# EasyEDA schematic SCH_BQ2954 PMIC_v1_2023-05-05.json
TITLE: BQ2954; REV: 1.0; Date: 2022-12-19; Sheet: 1/1; Drawn By: richwasnothere; Company: Your Company
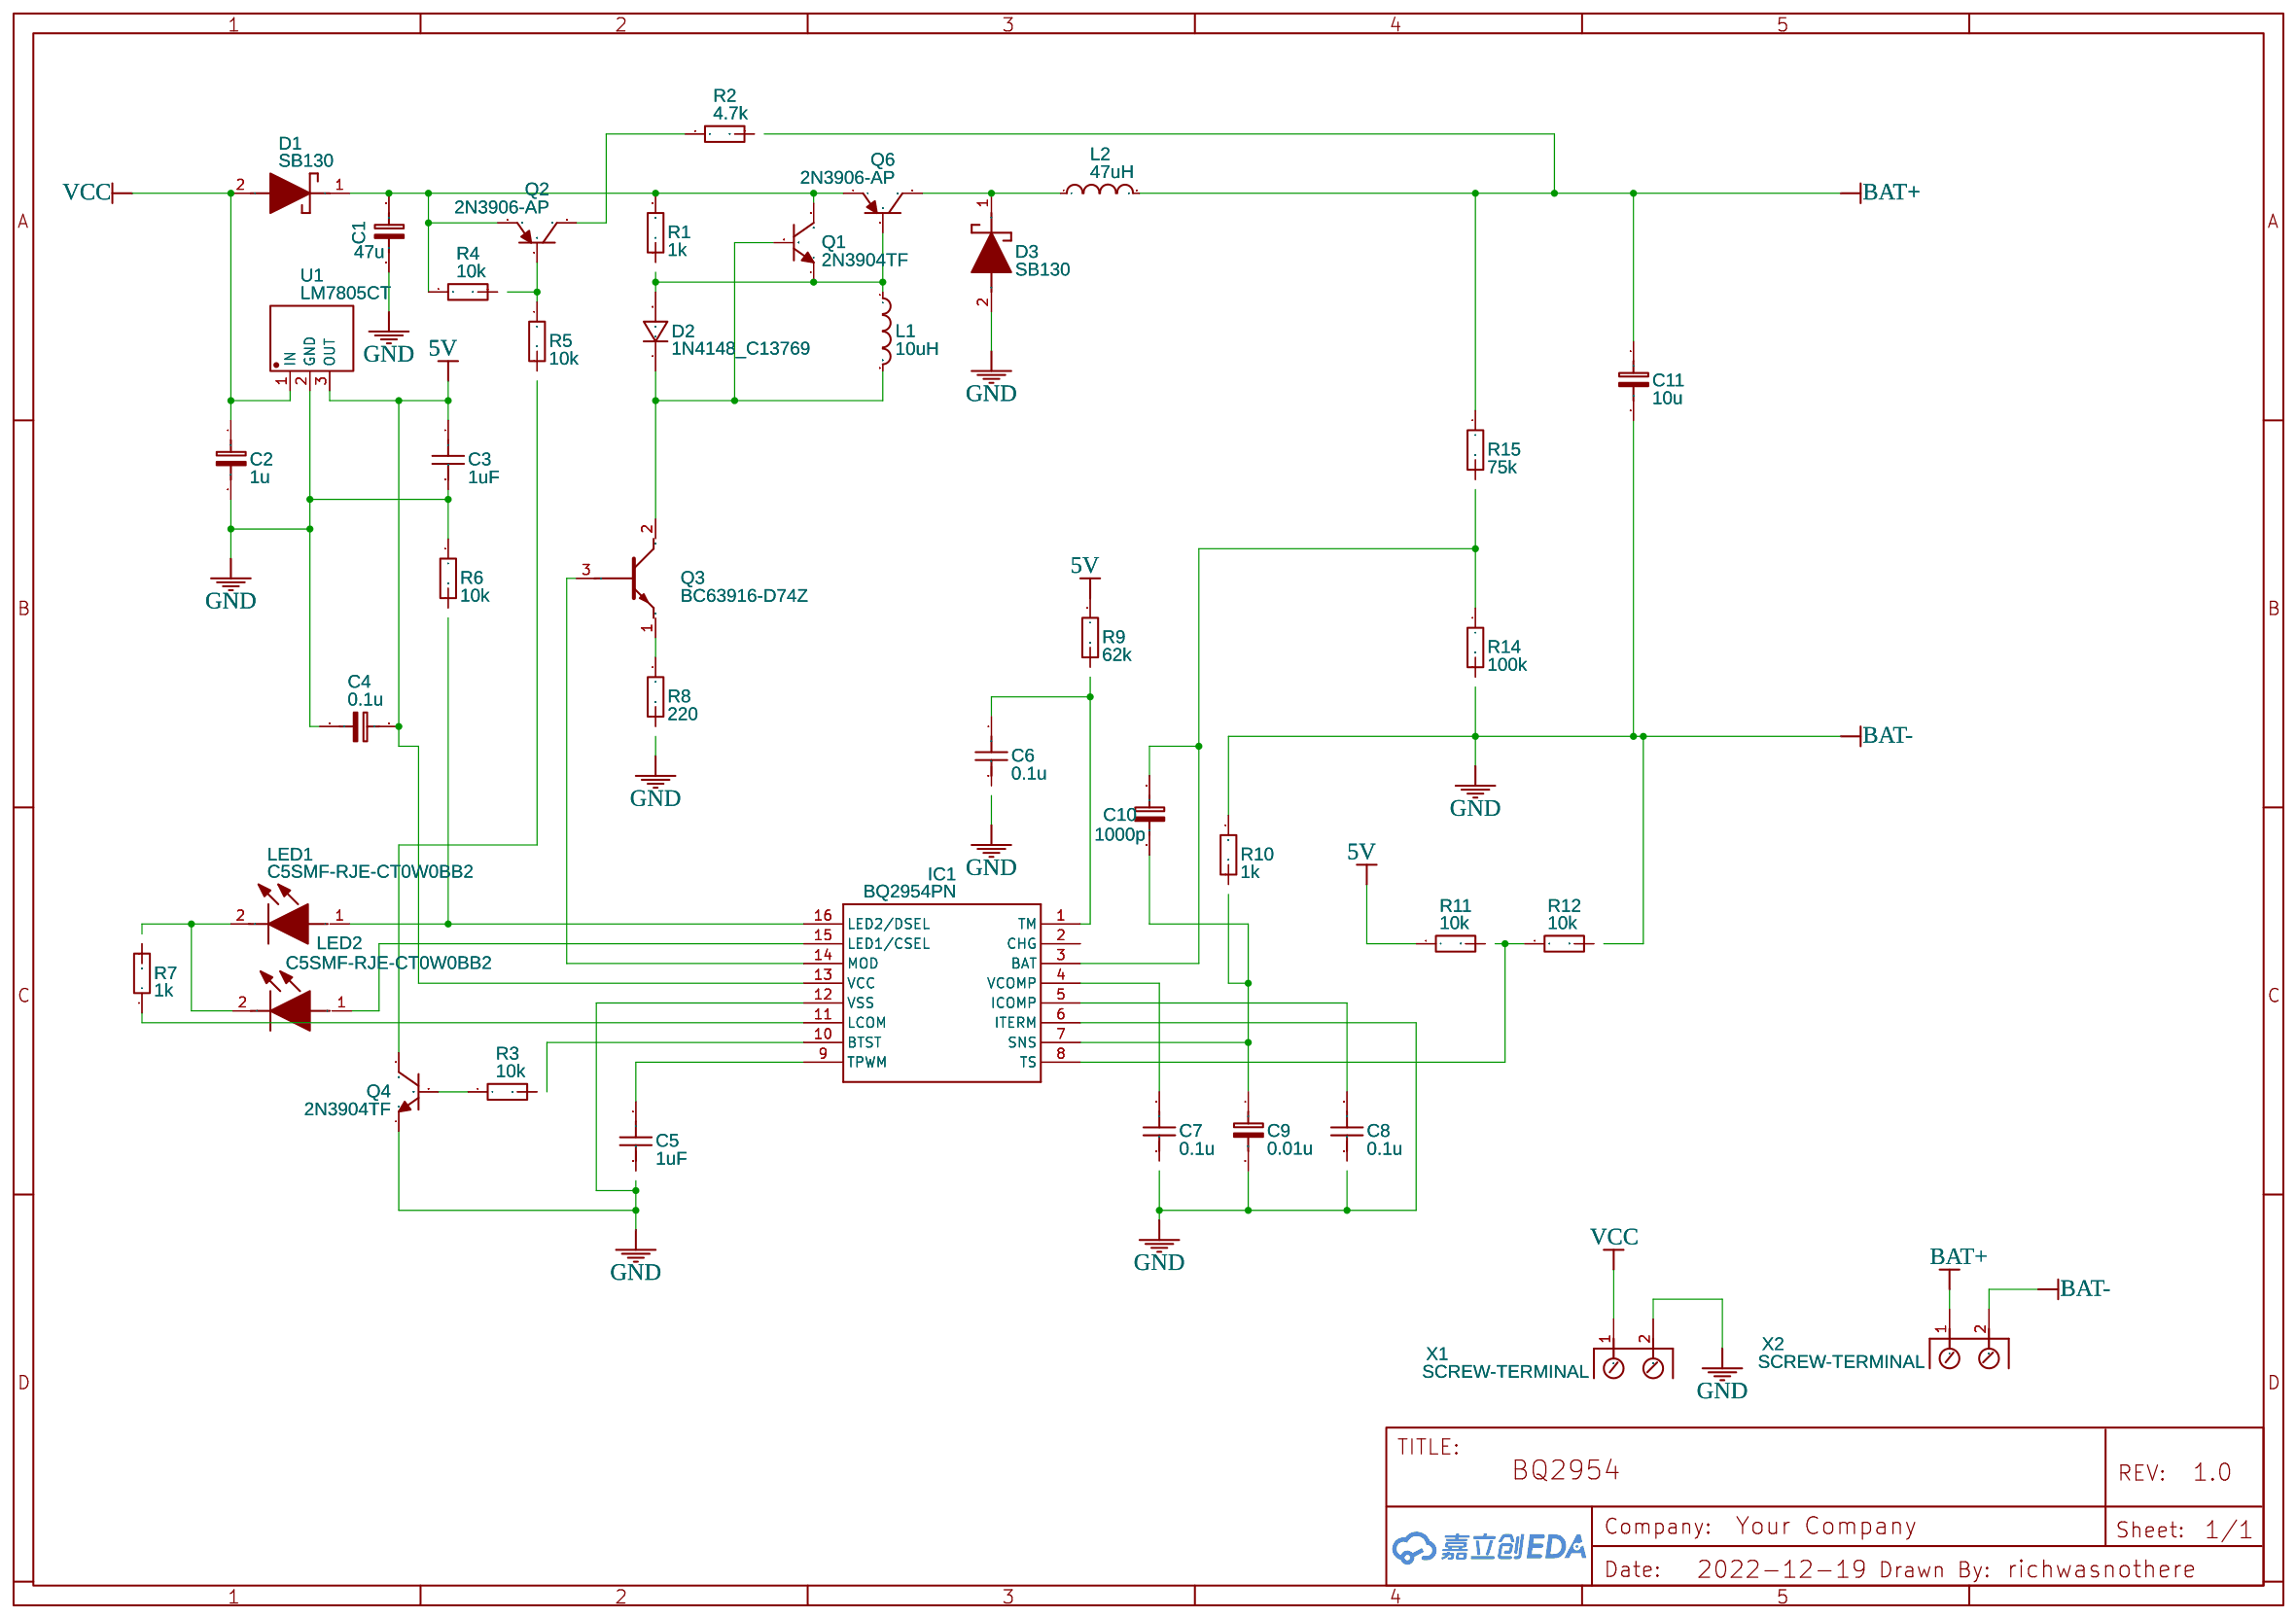
[diagram p0: schematic sheet]

## Parts
C1  47u  [CP_8X13MM]
C2  1u  [CP_8X13MM]
C3  1uF  [C1]
C4  0.1u  [CP_8X13MM]
C5  1uF  [C1]
C6  0.1u  [C1]
C7  0.1u  [C1]
C8  0.1u  [C1]
C9  0.01u  [CP_8X13MM]
C10  1000p  [CP_8X13MM]
C11  10u  [CP_8X13MM]
D1  SB130  [DIOAD1413W86L463D238]
D2  1N4148_C13769  [DO-35_BD2.0-L4.0-P8.0-D0.5-RD]
D3  SB130  [DIOAD1413W86L463D238]
IC1  BQ2954PN  [DIP794W53P254L1930H508Q16N]
L1  10uH  [L_AXIAL-0.6]
L2  47uH  [L_AXIAL-0.6]
LED1  C5SMF-RJE-CT0W0BB2  [C5SMFRJECT0W0BB2]
LED2  C5SMF-RJE-CT0W0BB2  [C5SMFRJECT0W0BB2]
Q1  2N3904TF  [TO-92-3_L5.1-W4.1-P1.27-L]
Q2  2N3906-AP  [TO-92-3_L4.8-W3.7-P2.54-L]
Q3  BC63916-D74Z  [KA431AZTA]
Q4  2N3904TF  [TO-92-3_L5.1-W4.1-P1.27-L]
Q6  2N3906-AP  [TO-92-3_L4.8-W3.7-P2.54-L]
R1  1k  [R3]
R2  4.7k  [R3]
R3  10k  [R3]
R4  10k  [R3]
R5  10k  [R3]
R6  10k  [R3]
R7  1k  [R3]
R8  220  [R3]
R9  62k  [R3]
R10  1k  [R3]
R11  10k  [R3]
R12  10k  [R3]
R14  100k  [R3]
R15  75k  [R3]
U1  LM7805CT  [TO-220-3_L10.0-W4.5-P2.54-L]
X1  SCREW-TERMINAL  [AKL701_2_13]
X2  SCREW-TERMINAL  [AKL701_2_13]

## Library data of the parts
C1-C11 = Capacitor: Manufacturer Part: ?
D1 D3 = SB130: Contributor: richwasnothere
D2 = 1N4148_C13769: Supplier: LCSC; Supplier Part: C13769; Manufacturer: STMicroelectronics; Manufacturer Part: 1N4148; Contributor: LCSC; JLCPCB Part Class: Extended Part
IC1 = BQ2954PN: Contributor: richwasnothere
L1 L2 = L_AXIAL-0.6_US: Contributor: LCEDA_Lib
LED1 LED2 = C5SMF-RJE-CT0W0BB2: Contributor: richwasnothere
Q1 Q4 = 2N3904TF: Supplier: LCSC; Supplier Part: C900703; Manufacturer: onsemi(安森美); Contributor: LCSC; JLCPCB Part Class: Extended Part
Q2 Q6 = 2N3906-AP: Supplier: LCSC; Supplier Part: C2987037; Manufacturer: MCC(美微科); link: https://atta.szlcsc.com/upload/public/pdf/source/20220330/5A2FB51D50249B7DD3CB82C599603F28.pdf; Contributor: LCSC
Q3 = BC63916-D74Z: Contributor: richwasnothere
R1-R12 R14 R15 = Resistor: Manufacturer Part: ?
U1 = LM7805CT: Supplier: LCSC; Manufacturer: onsemi(安森美); Supplier Part: C22146; JLCPCB Part Class: Extended Part
X1 X2 = -: catid: 20; sourceId: PU6sECcLl; Manufacturer Part: ?

## Nets
5V: C3.1 C4.1 IC1.13(VCC) R9.1 R11.1 U1.3(OUT)
VCC: C2.1 D1.2(A) U1.1(IN) X1.1
BAT+: C11.1 L2.2 R2.2 R15.1 X2.1
BAT-: C1.2 C2.2 C3.2 C4.2 C5.2 C6.2 C7.2 C8.2 C9.2 C11.2 D3.2(A) IC1.6(ITERM) IC1.12(VSS) Q4.1(E) R6.1 R8.2 R10.1 R12.2 R14.2 U1.2(GND) X1.2 X2.2
Net-(C1-1): C1.1 D1.1(K) Q1.3(C) Q2.1 Q6.1 R1.1 R4.1
Net-(C5-1): C5.1 IC1.9(TPWM)
Net-(C6-1): C6.1 IC1.1(TM) R9.2
Net-(C7-1): C7.1 IC1.4(VCOMP)
Net-(C8-1): C8.1 IC1.5(ICOMP)
Net-(C9-1): C9.1 C10.2 IC1.7(SNS) R10.2
Net-(C10-1): C10.1 IC1.3(BAT) R14.1 R15.2
Net-(D2-1): D2.1 L1.2 Q1.2(B) Q3.2(C)
Net-(D2-2): D2.2 L1.1 Q1.1(E) Q6.2 R1.2
Net-(D3-1): D3.1(K) L2.1 Q6.3
Net-(IC1-8): IC1.8(TS) R11.2 R12.1
Net-(IC1-10): IC1.10(BTST) R3.2
Net-(IC1-11): IC1.11(LCOM) R7.1
Net-(IC1-14): IC1.14(MOD) Q3.3(B)
Net-(IC1-15): IC1.15(LED1/CSEL) LED2.1(A)
Net-(IC1-16): IC1.16(LED2/DSEL) LED1.1(A) R6.2
Net-(LED1-2): LED1.2(K) LED2.2(K) R7.2
Net-(Q2-2): Q2.2 R4.2 R5.1
Net-(Q2-3): Q2.3 R2.1
Net-(Q3-1): Q3.1(E) R8.1
Net-(Q4-2): Q4.2(B) R3.1
Net-(Q4-3): Q4.3(C) R5.2

Not connected (* = marked no-connect by the designer): IC1 2(CHG)
